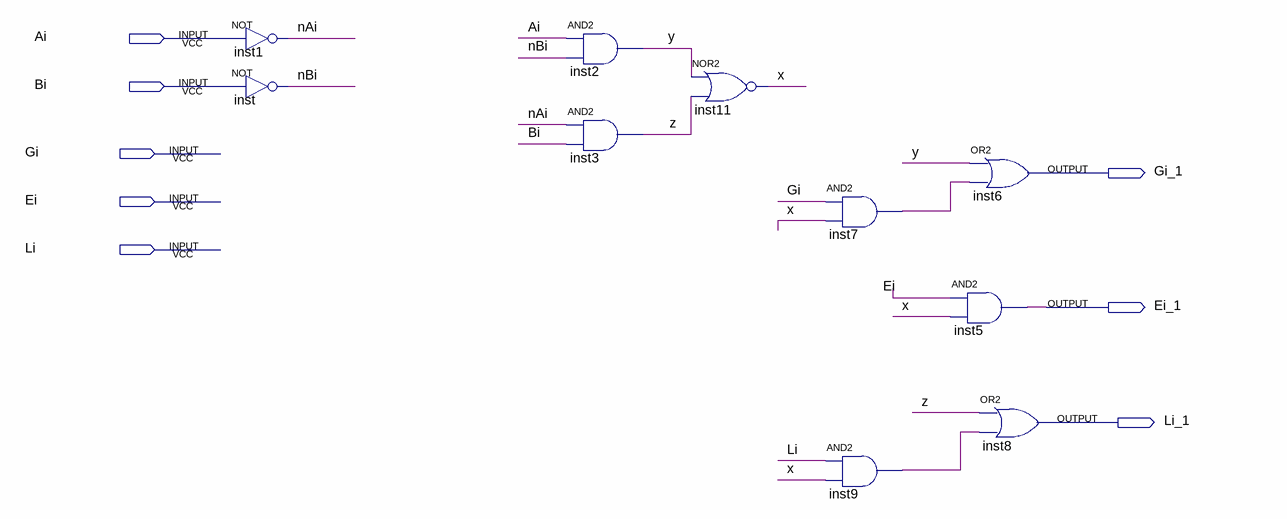
[diagram p0: schematic sheet]
// Quartus schematic MojCMP1.bdf as structural Verilog: 10 symbols, 8 pins
module MojCMP1 (
  input  Ai,
  input  Bi,
  input  Gi,
  input  Ei,
  input  Li,
  output Gi_1,
  output Ei_1,
  output Li_1
);

  wire inst7_out, inst9_out, nAi, nBi, x, y, z;

  not inst1 (nAi, Ai);
  not inst (nBi, Bi);
  and inst2 (y, Ai, nBi);
  and inst3 (z, nAi, Bi);
  nor inst11 (x, y, z);
  and inst7 (inst7_out, Gi, x);
  and inst9 (inst9_out, Li, x);
  or inst6 (Gi_1, y, inst7_out);
  and inst5 (Ei_1, Ei, x);
  or inst8 (Li_1, z, inst9_out);
endmodule
